# EAGLE design FX-Flash_DIP_rev_B (EAGLE 9.6.2)
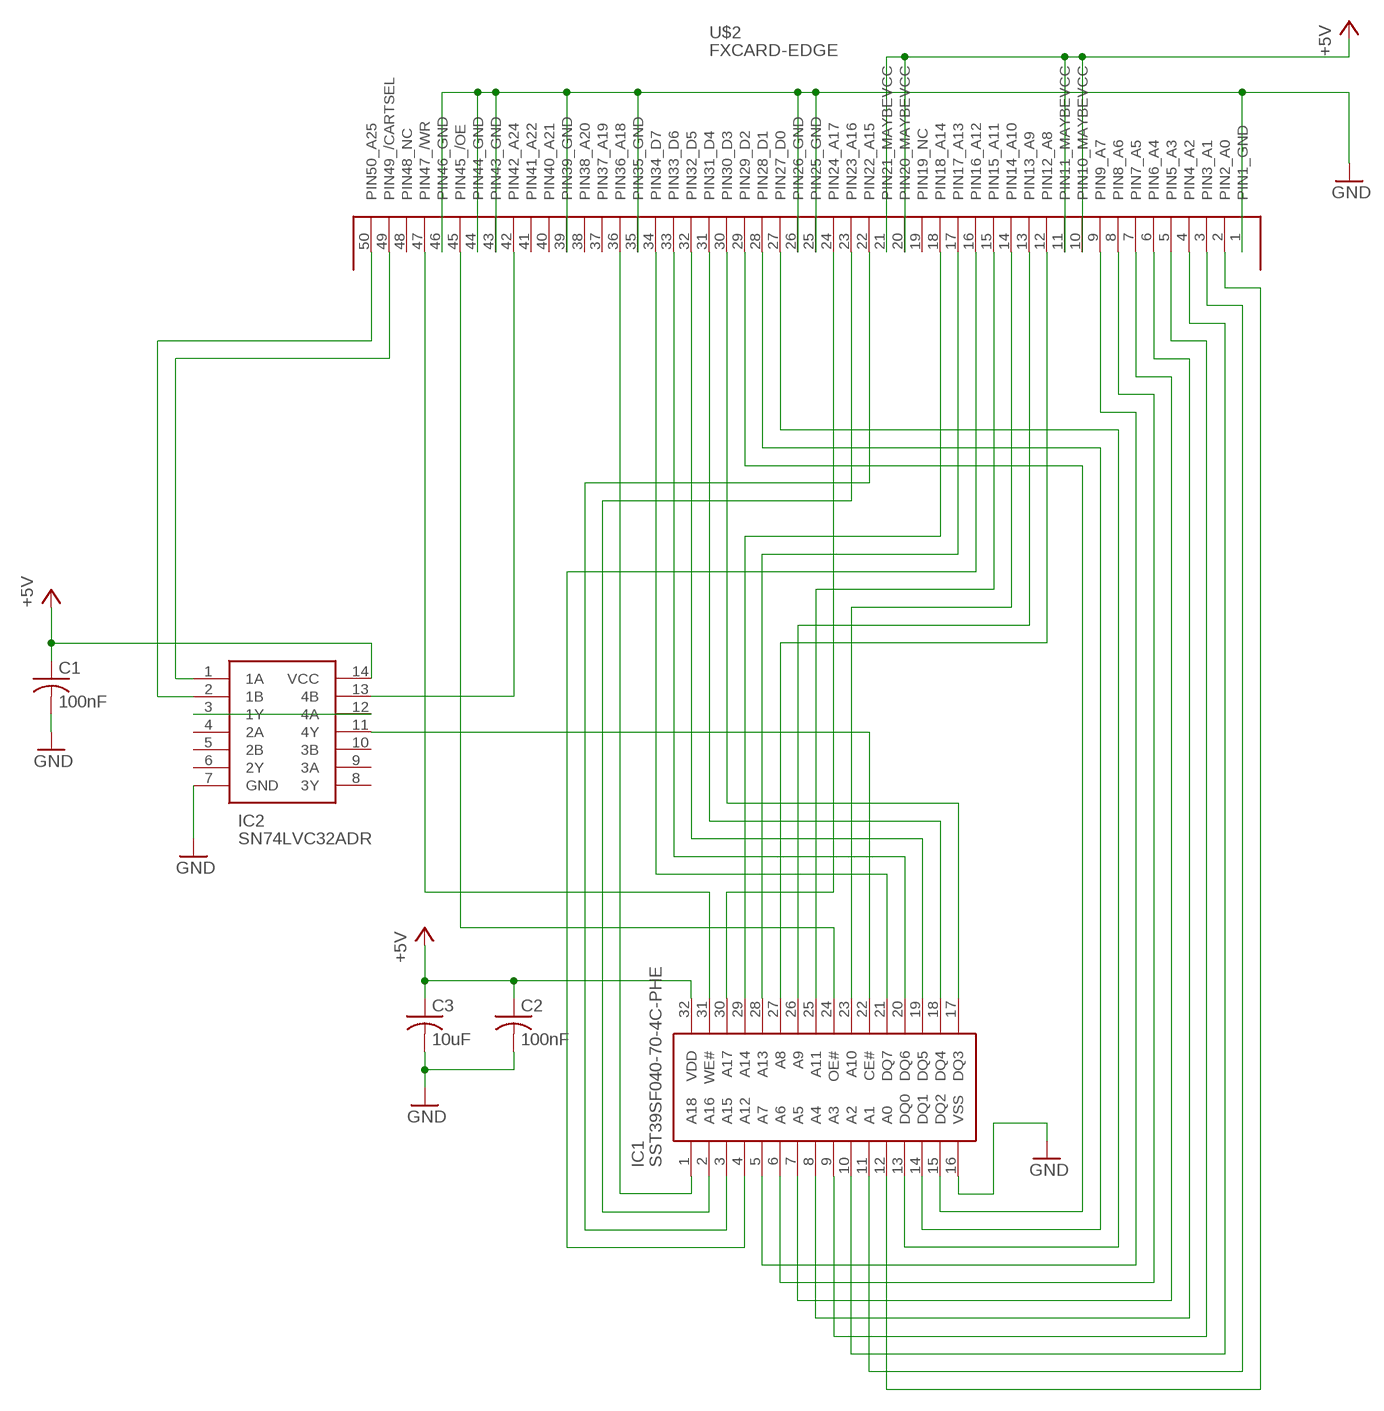
[diagram p0: schematic, sheet 1]

## Parts
C1  100nF  C-USC0402  [C0402]
C2  100nF  C-USC0402  [C0402]
C3  10uF  C-USC0805  [C0805]
IC1  SST39SF040-70-4C-PHE  [DIP1556W56P254L4191H508Q32N]
IC2  SN74LVC32ADR  [SOIC127P600X175-14N]
U$2  FXCARD-EDGE  [FXCARD-EDGE]

## Nets
+5V: C1.1 C2.1 C3.1 IC1.32(VDD) IC2.14(VCC) U$2.10(PIN10_MAYBEVCC) U$2.11(PIN11_MAYBEVCC) U$2.20(PIN20_MAYBEVCC) U$2.21(PIN21_MAYBEVCC)
GND: C1.2 C2.2 C3.2 IC1.16(VSS) IC2.7(GND) U$2.1(PIN1_GND) U$2.25(PIN25_GND) U$2.26(PIN26_GND) U$2.35(PIN35_GND) U$2.39(PIN39_GND) U$2.43(PIN43_GND) U$2.44(PIN44_GND) U$2.46(PIN46_GND)
N$1: IC1.18(DQ4) U$2.31(PIN31_D4)
N$2: IC1.17(DQ3) U$2.30(PIN30_D3)
N$3: IC2.13(4B) U$2.42(PIN42_A24)
N$4: IC2.3(1Y) IC2.12(4A)
N$5: IC1.22(CE#) IC2.11(4Y)
N$6: IC1.31(WE#) U$2.47(PIN47_/WR)
N$7: IC1.24(OE#) U$2.45(PIN45_/OE)
N$8: IC1.1(A18) U$2.36(PIN36_A18)
N$9: IC1.30(A17) U$2.24(PIN24_A17)
N$10: IC1.2(A16) U$2.23(PIN23_A16)
N$11: IC1.3(A15) U$2.22(PIN22_A15)
N$12: IC1.29(A14) U$2.18(PIN18_A14)
N$13: IC1.28(A13) U$2.17(PIN17_A13)
N$14: IC1.4(A12) U$2.16(PIN16_A12)
N$15: IC1.25(A11) U$2.15(PIN15_A11)
N$16: IC1.23(A10) U$2.14(PIN14_A10)
N$17: IC1.21(DQ7) U$2.34(PIN34_D7)
N$18: IC1.20(DQ6) U$2.33(PIN33_D6)
N$19: IC1.19(DQ5) U$2.32(PIN32_D5)
N$20: IC1.26(A9) U$2.13(PIN13_A9)
N$21: IC1.27(A8) U$2.12(PIN12_A8)
N$22: IC2.2(1B) U$2.50(PIN50_A25)
N$23: IC2.1(1A) U$2.49(PIN49_/CARTSEL)
N$24: IC1.15(DQ2) U$2.29(PIN29_D2)
N$25: IC1.14(DQ1) U$2.28(PIN28_D1)
N$26: IC1.13(DQ0) U$2.27(PIN27_D0)
N$27: IC1.5(A7) U$2.9(PIN9_A7)
N$28: IC1.6(A6) U$2.8(PIN8_A6)
N$29: IC1.7(A5) U$2.7(PIN7_A5)
N$30: IC1.8(A4) U$2.6(PIN6_A4)
N$31: IC1.9(A3) U$2.5(PIN5_A3)
N$32: IC1.10(A2) U$2.4(PIN4_A2)
N$33: IC1.11(A1) U$2.3(PIN3_A1)
N$34: IC1.12(A0) U$2.2(PIN2_A0)
Unconnected: IC2.4(2A) IC2.5(2B) IC2.6(2Y) IC2.8(3Y) IC2.9(3A) IC2.10(3B) U$2.19(PIN19_NC) U$2.37(PIN37_A19) U$2.38(PIN38_A20) U$2.40(PIN40_A21) U$2.41(PIN41_A22) U$2.48(PIN48_NC)

## Library data of the parts
C1 C2 = PC-Engine0402:C-US: CAPACITOR, American symbol
C3 = resistor:C-US: CAPACITOR, American symbol
IC1 = PC-Engine:SST39SF040-70-4C-PHE: Microchip SST39SF040-70-4C-PHE, Parallel, Serial 4Mbit Flash Memory, 70ns; 5V, PDIP, 32-Pin Source: Datasheet <http://ww1.microchip.com/downloads/en/DeviceDoc/20005022C.pdf>; ALLIED_NUMBER: 70048094; ALLIED_PRICE-STOCK: https://www.alliedelec.com/microchip-technology-inc-sst39sf040-70-4c-phe/70048094/; DESCRIPTION: Microchip SST39SF040-70-4C-PHE, Parallel, Serial 4Mbit Flash Memory, 70ns; 5V, PDIP, 32-Pin; HEIGHT: 5.08mm; MANUFACTURER_NAME: Microchip; MANUFACTURER_PART_NUMBER: SST39SF040-70-4C-PHE; MOUSER_PART_NUMBER: 804-39SF0407CPHE; MOUSER_PRICE-STOCK: https://www.mouser.com/Search/Refine.aspx?Keyword=804-39SF0407CPHE; RS_PART_NUMBER: 8104037P; RS_PRICE-STOCK: http://uk.rs-online.com/web/p/products/8104037P
IC2 = PC-Engine:SN74LVC32ADR: Texas Instruments SN74LVC32ADR, OR Quad 2 Input OR, 1.65 3.6 V, 14-Pin SOIC Source: Datasheet <http://www.ti.com/lit/gpn/sn74lvc32a>; ARROW_PART_NUMBER: SN74LVC32ADR; ARROW_PRICE-STOCK: https://www.arrow.com/en/products/sn74lvc32adr/texas-instruments; DESCRIPTION: Texas Instruments SN74LVC32ADR, OR Quad 2 Input OR, 1.65 3.6 V, 14-Pin SOIC; HEIGHT: 1.75mm; MANUFACTURER_NAME: Texas Instruments; MANUFACTURER_PART_NUMBER: SN74LVC32ADR; MOUSER_PART_NUMBER: 595-SN74LVC32ADR; MOUSER_PRICE-STOCK: https://www.mouser.co.uk/ProductDetail/Texas-Instruments/SN74LVC32ADR?qs=NLW4NjXEBS7KFLqI%2FYoHOA%3D%3D
U$2 = PC-Engine:FXCARD-EDGE

## Board
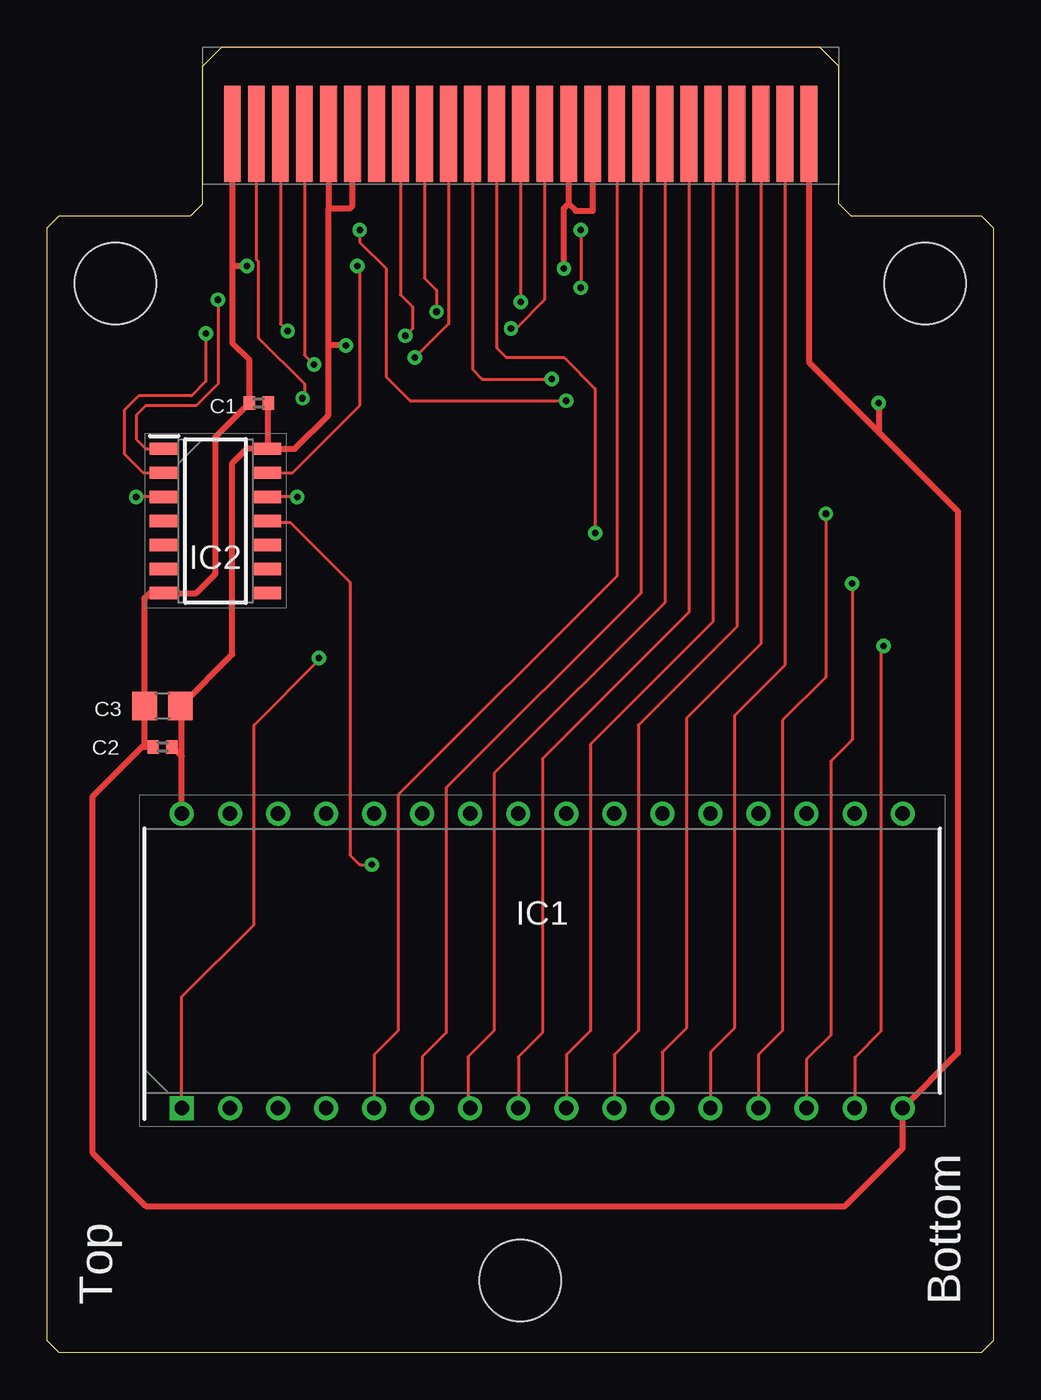
[diagram p1: board, top side]
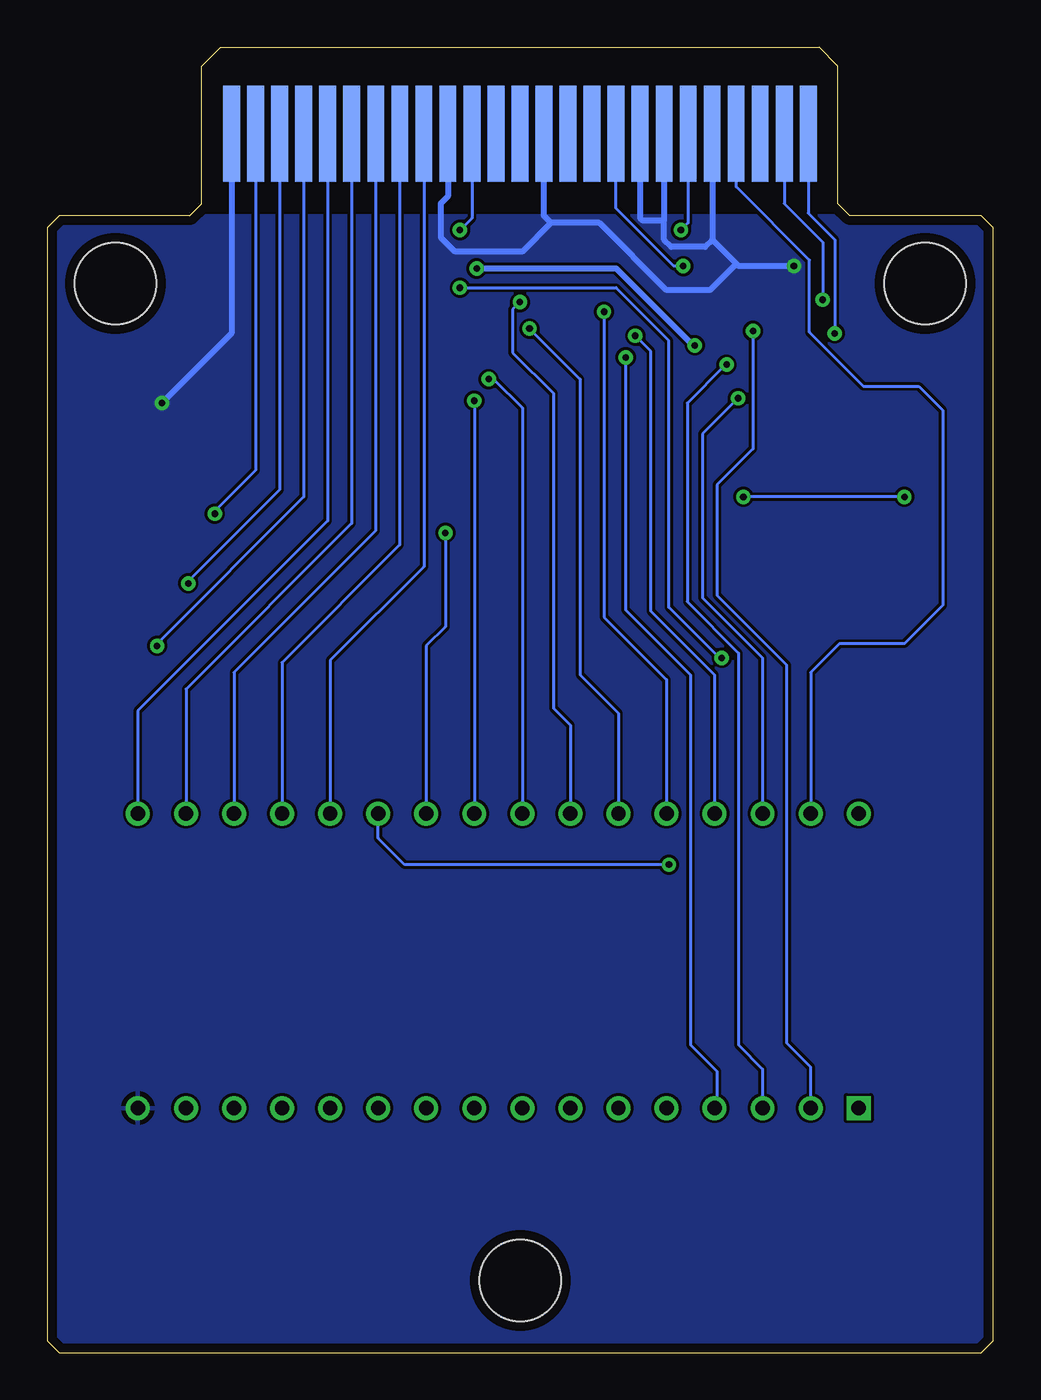
[diagram p2: board, bottom side, seen from below]

Size 50 x 68.96 mm. Coordinates in mm from the lower left corner, seen from the top.
Outline: 42.47,60.07 49.37,60.07 50,59.44 50,0.64 49.37,0 0.64,0 0,0.64 0,59.44 0.64,60.07 7.57,60.07 8.2,60.71 8.2,67.96 9.2,68.96 40.83,68.96 41.83,67.96 41.83,60.71 42.47,60.07
Copper layers (1*16): Top 0.035mm / dielectric 1.5mm / Bottom 0.035mm
Design rules "default *": minimum track width 6mil, minimum drill 0.35mm, track to track 6mil, track to pad 6mil, pad to pad 6mil, via to via 6mil, smd to smd 6mil, copper to edge 20mil, drill to drill 6mil, minimum pad ring 10mil, minimum via ring 8mil, stop-mask expansion 2mil, vias tented up to drill 15mil, thermal gap 10mil
Holes 4.3 mm at 3.6,56.49 46.4,56.49 25,3.81

### Footprints (pad centres in the part's own frame; a part is rotated, then mirrored left to right if it is on the bottom)
C0402 = smd 0.6 x 0.7: 1 -0.5,0; 2 0.5,0
C0805 = smd 1.3 x 1.5: 1 -0.95,0; 2 0.95,0
DIP1556W56P254L4191H508Q32N = drill 0.758 pad 1.158 square: 1 -7.779,19.05 | drill 0.758 pad 1.158: 2 -7.779,16.51; 3 -7.779,13.97; 4 -7.779,11.43; 5 -7.779,8.89; 6 -7.779,6.35; 7 -7.779,3.81; 8 -7.779,1.27; 9 -7.779,-1.27; 10 -7.779,-3.81; 11 -7.779,-6.35; 12 -7.779,-8.89; 13 -7.779,-11.43; 14 -7.779,-13.97; 15 -7.779,-16.51; 16 -7.779,-19.05; 17 7.779,-19.05; 18 7.779,-16.51; 19 7.779,-13.97; 20 7.779,-11.43; 21 7.779,-8.89; 22 7.779,-6.35; 23 7.779,-3.81; 24 7.779,-1.27; 25 7.779,1.27; 26 7.779,3.81; 27 7.779,6.35; 28 7.779,8.89; 29 7.779,11.43; 30 7.779,13.97; 31 7.779,16.51; 32 7.779,19.05
SOIC127P600X175-14N = smd 1.525 x 0.65: 1 -2.712,3.81; 2 -2.712,2.54; 3 -2.712,1.27; 4 -2.712,0; 5 -2.712,-1.27; 6 -2.712,-2.54; 7 -2.712,-3.81; 8 2.712,-3.81; 9 2.712,-2.54; 10 2.712,-1.27; 11 2.712,0; 12 2.712,1.27; 13 2.712,2.54; 14 2.712,3.81
FXCARD-EDGE = smd 0.889 x 5.08: 1 32.055,-4.572; 2 30.785,-4.572; 3 29.515,-4.572; 4 28.245,-4.572; 5 26.975,-4.572; 6 25.705,-4.572; 7 24.435,-4.572; 8 23.165,-4.572; 9 21.895,-4.572; 10 20.625,-4.572; 11 19.355,-4.572; 12 18.085,-4.572; 13 16.815,-4.572; 14 15.545,-4.572; 15 14.275,-4.572; 16 13.005,-4.572; 17 11.735,-4.572; 18 10.465,-4.572; 19 9.195,-4.572; 20 7.925,-4.572; 21 6.655,-4.572; 22 5.385,-4.572; 23 4.115,-4.572; 24 2.845,-4.572; 25 1.575,-4.572 | smd 0.889 x 5.08 bottom: 26 32.055,-4.572; 27 30.785,-4.572; 28 29.515,-4.572; 29 28.245,-4.572; 30 26.975,-4.572; 31 25.705,-4.572; 32 24.435,-4.572; 33 23.165,-4.572; 34 21.895,-4.572; 35 20.625,-4.572; 36 19.355,-4.572; 37 18.085,-4.572; 38 16.815,-4.572; 39 15.545,-4.572; 40 14.275,-4.572; 41 13.005,-4.572; 42 11.735,-4.572; 43 10.465,-4.572; 44 9.195,-4.572; 45 7.925,-4.572; 46 6.655,-4.572; 47 5.385,-4.572; 48 4.115,-4.572; 49 2.845,-4.572; 50 1.575,-4.572

### Placement (x,y rotation side)
C1  11.18,50.16 180 top
C2  6.1,32 180 top
C3  6.1,34.16 180 top
IC1  26.16,20.7 90 top
IC2  8.89,43.94 0 top
U$2  8.2,68.96 0 top

### Tracks (layer width: path | path; a pad name or v marks a point on that pad's centre or on a via)
+5V  (via drill 0.35)
  Top 0.305: U$2.10 28.83,60.33 27.94,60.33 27.56,60.71 | U$2.11 27.56,60.71 | U$2.21 14.86,60.45 | IC2.14 13.08,47.75 14.86,49.53 14.86,53.21 | 14.86,53.21 14.86,60.45 | IC2.14 11.68,47.83 C1.1 | IC2.14 10.54,47.75 9.78,46.99 9.78,36.9 C3.1 7.11,34.1 7.11,31.49 | 14.86,60.45 16,60.45 16.13,60.58 U$2.20 | v15.78,53.21 14.86,53.21 | v27.3,57.28 27.3,60.45 27.56,60.71 | IC1.32 7.11,31.49 | 7.11,31.49 C2.1
  Bottom 0.305: v27.3,57.28 19.94,57.28 15.88,53.21 v15.78,53.21
GND  (via drill 0.35)
  Top 0.152: 43.94,48.64 44.51,48.07
  Top 0.305: U$2.1 40.26,52.32 44.51,48.07 48.13,44.45 48.13,15.84 IC1.16 45.21,10.79 42.16,7.75 5.21,7.75 2.41,10.54 2.41,29.4 5.02,32 | v43.94,50.16 43.94,48.64 | U$2.25 9.78,57.4 | 9.78,57.4 9.78,53.34 10.68,52.44 C1.2 8.89,48.38 8.89,41.15 7.87,40.13 IC2.7 5.42,40.13 5.15,39.86 C3.2 5.15,32.13 5.02,32 | v10.54,57.4 9.78,57.4 | 5.02,32 C2.2
  Bottom 0.305: U$2.1 40.26,53.85 v43.94,50.16 | U$2.44 17.4,59.82 | U$2.46 14.86,58.8 | 17.4,59.82 17.4,58.8 17.02,58.42 15.24,58.42 14.86,58.8 | v10.54,57.4 13.46,57.4 13.59,57.53 | 14.86,58.8 13.59,57.53 | 13.59,57.53 14.99,56.13 17.27,56.13 20.83,59.69 23.37,59.69 | 23.37,59.69 23.75,60.07 U$2.39 | U$2.35 28.83,61.09 29.21,60.71 29.21,58.93 28.45,58.17 24.89,58.17 23.37,59.69 | 17.4,59.82 18.54,59.82 18.67,59.94 U$2.43
  pour Bottom: -0.76,-0.64 -0.76,59.31 0,60.07 50.55,60.07 50.55,-0.64
N$1
  Bottom 0.152: U$2.31 33.91,43.81 42.67,35.05 IC1.18
N$2
  Bottom 0.152: U$2.30 35.18,43.94 45.21,33.91 IC1.17
N$3  (via drill 0.35)
  Top 0.152: IC2.13 12.95,46.48 16.51,50.04 16.51,57.28 v16.38,57.4
  Bottom 0.152: v16.38,57.4 16.89,57.4 19.94,60.45 U$2.42
N$4  (via drill 0.35)
  Top 0.152: v13.21,45.21 IC2.12 | IC2.3 v4.7,45.21
  Bottom 0.152: v4.7,45.21 v13.21,45.21
N$5  (via drill 0.35)
  Top 0.152: IC2.11 11.68,43.86 12.84,43.86 16,40.7 16,26.29 16.51,25.78 v17.14,25.78
  Bottom 0.152: v17.14,25.78 31.11,25.78 32.51,27.18 IC1.22
N$6
  Bottom 0.152: IC1.31 9.65,35.94 8.13,37.47 4.7,37.47 2.67,39.5 2.67,49.78 3.94,51.05 6.86,51.05 9.72,53.91 9.72,57.72 13.59,61.59 U$2.47
N$7  (via drill 0.35)
  Top 0.152: v16.51,59.31 16.51,58.67 17.91,57.28 17.91,51.56 19.18,50.29 v27.43,50.29
  Bottom 0.152: U$2.45 16.13,59.69 v16.51,59.31 | v27.43,50.29 IC1.24
N$8  (via drill 0.35)
  Top 0.152: IC1.1 7.11,18.8 10.92,22.61 10.92,33.15 14.35,36.58 v14.35,36.7 | v28.19,59.31 v28.19,56.26
  Bottom 0.152: v28.19,56.26 19.94,56.26 17.14,53.47 17.14,39.37 14.48,36.7 v14.35,36.7 | U$2.36 27.56,59.94 v28.19,59.31
N$9  (via drill 0.35)
  Top 0.152: U$2.24 11.05,57.75 11.15,57.66 11.15,53.62 13.59,51.18 13.59,50.52 v13.49,50.42
  Bottom 0.152: v13.49,50.42 15.37,48.54 15.37,39.88 12.19,36.7 IC1.30
N$10  (via drill 0.35)
  Top 0.152: U$2.23 12.32,54.36 v12.7,53.98
  Bottom 0.152: v12.7,53.98 12.7,47.75 14.61,45.85 14.61,40.01 10.92,36.32 10.92,16.35 9.65,15.08 IC1.2
N$11  (via drill 0.35)
  Top 0.152: U$2.22 13.59,52.7 v14.1,52.2
  Bottom 0.152: v14.1,52.2 14.15,52.2 16.18,50.16 16.18,39.67 13.46,36.96 13.46,16.26 12.19,14.99 IC1.3
N$12  (via drill 0.35)
  Top 0.152: U$2.18 18.67,55.88 19.3,55.24 19.3,54.1 v18.92,53.72
  Bottom 0.152: IC1.29 14.73,35.81 18.1,39.18 18.1,52.9 v18.92,53.72
N$13  (via drill 0.35)
  Top 0.152: U$2.17 19.94,56.77 20.57,56.13 v20.57,54.99
  Bottom 0.152: v20.57,54.99 20.57,38.86 17.27,35.56 IC1.28
N$14  (via drill 0.35)
  Top 0.152: U$2.16 21.21,54.36 v19.43,52.58
  Bottom 0.152: v19.43,52.58 19.43,39.24 16,35.81 16,16.26 14.61,14.86 14.61,13.05 IC1.4
N$15  (via drill 0.35)
  Top 0.152: U$2.15 22.48,51.94 22.99,51.44 v26.67,51.44
  Bottom 0.152: v26.67,51.44 26.42,51.44 24.89,49.91 IC1.25
N$16  (via drill 0.35)
  Top 0.152: U$2.14 23.75,53.09 24.26,52.58 27.3,52.58 28.96,50.93 v28.96,43.31
  Bottom 0.152: IC1.23 29.97,37.34 28.96,38.35 v28.96,43.31
N$17
  Bottom 0.152: U$2.34 30.1,41.53 35.05,36.58 IC1.21
N$18
  Bottom 0.152: U$2.33 31.37,42.67 37.59,36.45 IC1.20
N$19
  Bottom 0.152: U$2.32 32.64,43.43 40.13,35.94 IC1.19
N$20  (via drill 0.35)
  Top 0.152: U$2.13 v25.02,55.5
  Bottom 0.152: v25.02,55.5 25.4,55.12 25.4,52.83 23.24,50.67 23.24,34.04 22.35,33.15 IC1.26
N$21  (via drill 0.35)
  Top 0.152: U$2.12 26.29,55.63 24.77,54.1 v24.51,54.1
  Bottom 0.152: v24.51,54.1 21.84,51.44 21.84,35.81 19.81,33.78 IC1.27
N$22  (via drill 0.35)
  Top 0.152: IC2.2 5.08,46.48 4.06,47.5 4.06,49.78 4.83,50.55 7.62,50.55 8.38,51.31 v8.38,53.85
  Bottom 0.152: U$2.50 9.78,60.2 8.38,58.8 v8.38,53.85
N$23  (via drill 0.35)
  Top 0.152: IC2.1 5.21,47.75 4.7,48.26 4.7,49.53 5.21,50.04 7.87,50.04 9.02,51.18 v9.02,55.63
  Bottom 0.152: U$2.49 11.05,60.71 9.02,58.67 v9.02,55.63
N$24  (via drill 0.35)
  Top 0.152: v44.2,37.34 44.07,37.21 44.07,16.99 42.67,15.59 IC1.15
  Bottom 0.152: U$2.29 36.45,45.21 44.2,37.47 v44.2,37.34
N$25  (via drill 0.35)
  Top 0.152: v42.55,40.64 42.55,32.38 41.4,31.24 41.4,16.76 40.13,15.49 IC1.14
  Bottom 0.152: U$2.28 37.72,45.59 42.55,40.77 v42.55,40.64
N$26  (via drill 0.35)
  Top 0.152: v41.15,44.32 41.15,35.69 38.86,33.4 38.86,17.02 37.59,15.75 IC1.13
  Bottom 0.152: U$2.27 38.99,46.61 41.15,44.45 v41.15,44.32
N$27
  Top 0.152: U$2.9 30.1,41.02 18.54,29.46 18.54,17.02 17.27,15.75 IC1.5
N$28
  Top 0.152: U$2.8 31.37,40.13 21.08,29.84 21.08,16.89 19.81,15.62 IC1.6
N$29
  Top 0.152: U$2.7 32.64,39.62 23.62,30.61 23.62,22.48 23.62,22.35 23.62,17.02 22.23,15.62 22.23,13.05 IC1.7
N$30
  Top 0.152: U$2.6 33.91,39.12 26.16,31.37 26.16,16.89 24.89,15.62 IC1.8
N$31
  Top 0.152: U$2.5 35.18,38.61 28.7,32.13 28.7,17.02 27.43,15.75 IC1.9
N$32
  Top 0.152: U$2.4 36.45,38.35 31.24,33.15 31.24,17.02 29.97,15.75 IC1.10
N$33
  Top 0.152: U$2.3 37.72,37.47 33.78,33.53 33.78,17.14 32.51,15.88 IC1.11
N$34
  Top 0.152: U$2.2 38.99,36.32 36.32,33.66 36.32,17.14 35.05,15.88 IC1.12

### Text on the board
tNames: Top | Bottom
tValues: 25 | 1 | FX-Flash | Board Rev. B | Prototype by / David Shadoff / (c) 2022
bValues: 50 | 26 | JLCJLCJLCJLC